# Altium schematic sheet connector.SchDoc
size A3
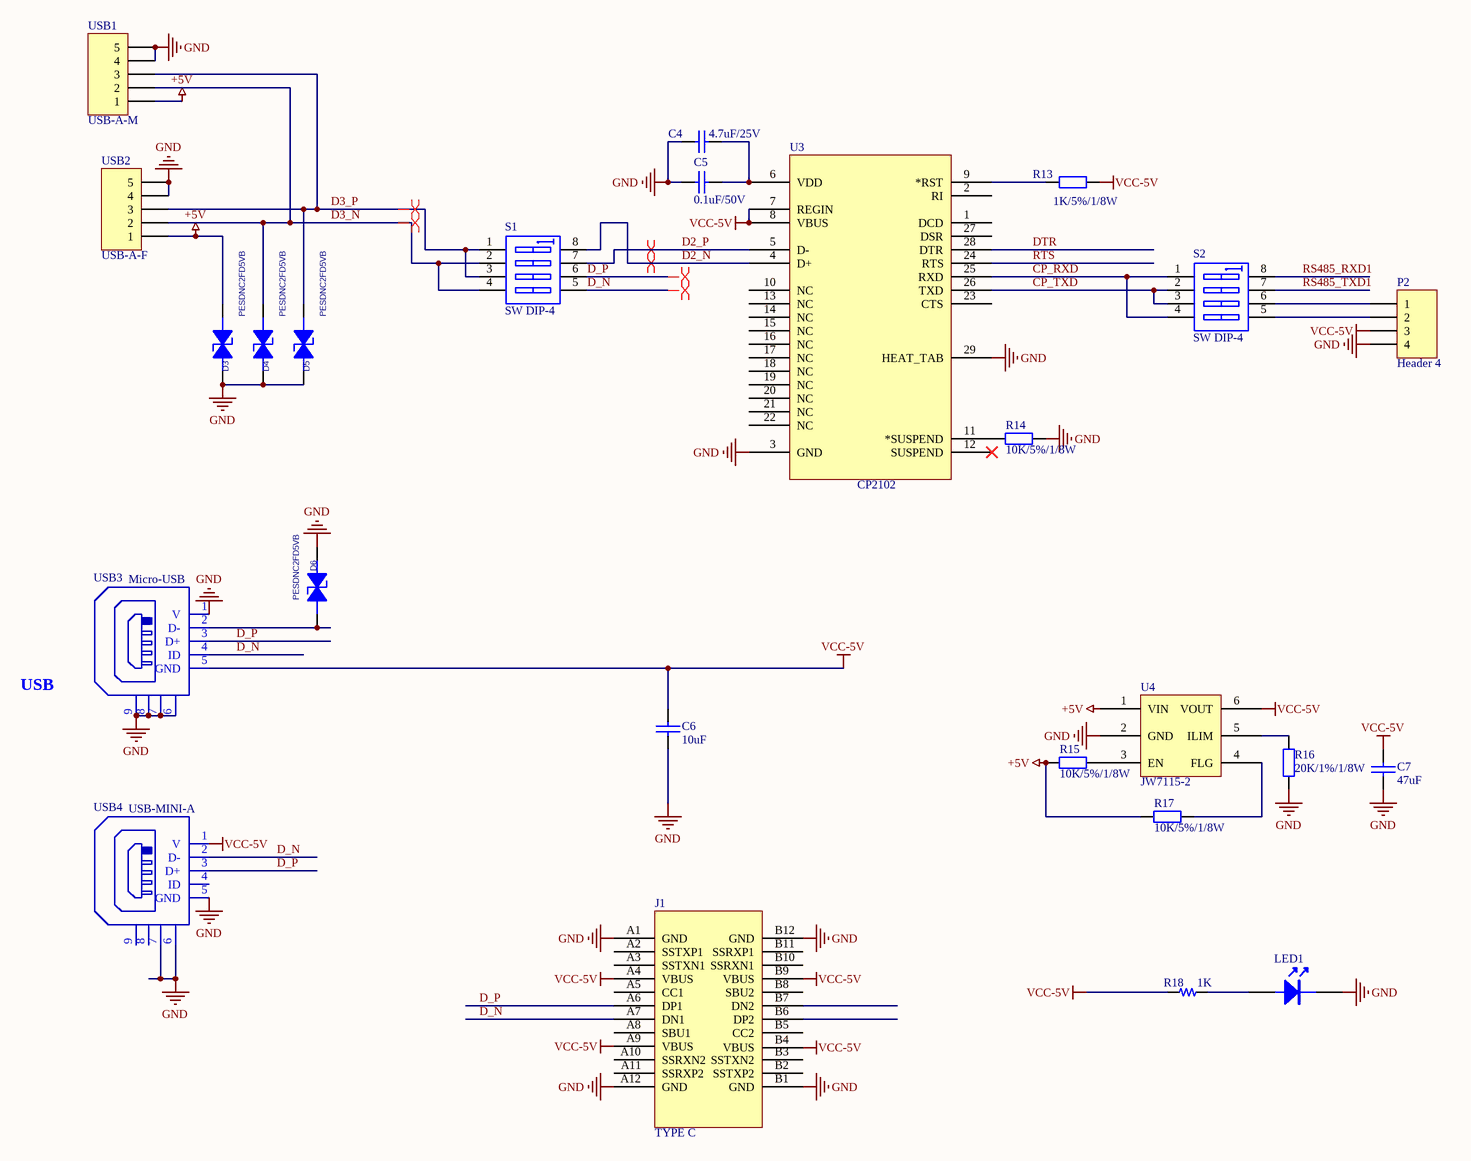
[diagram p0: connector.SchDoc]

## Parts
C4  4.7uF/25V  [0603C]
C5  0.1uF/50V  [C0603]
C6  10uF  [0603C]
C7  47uF  [0603C]
D3  PESDNC2FD5VB  [C0402]
D4  PESDNC2FD5VB  [C0402]
D5  PESDNC2FD5VB  [C0402]
D6  PESDNC2FD5VB  [C0402]
J1  TYPE C  [Type_C-M]
LED1  (no value)  [0603LED]
P2  Header 4  [HDR1X4]
R13  1K/5%/1/8W  [0603R]
R14  10K/5%/1/8W  [0603R]
R15  10K/5%/1/8W  [0603R]
R16  20K/1%/1/8W  [0603R]
R17  10K/5%/1/8W  [0603R]
R18  1K  [0603R]
S1  SW DIP-4  [SW_SMT_8]
S2  SW DIP-4  [SW_SMT_8]
U3  CP2102  [QFN28N5X5-0p5P-L]
U4  JW7115-2  [SOT23-6]
USB1  USB-A-M  [USB_A/P_A]
USB2  USB-A-F  [USB-A]
USB3  Micro-USB  [MICRO USB M]
USB4  USB-MINI-A  [MINIUSB-M]

## Nets
+5V: D3.1(ANODE) R15.2 R17.2 U4.1(VIN) USB1.1 USB2.1
GND: C4.1 C5.2 C6.1 C7.1 D3.2(CATHODE) D4.2(CATHODE) D5.2(CATHODE) D6.2(CATHODE) J1.A1(GND) J1.A12(GND) J1.B1(GND) J1.B12(GND) LED1.2 P2.4 R14.1 R16.2 U3.3(GND) U3.29(HEAT_TAB) U4.2(GND) USB1.4 USB1.5 USB2.4 USB2.5 USB3.1(V) USB3.6 USB3.7 USB3.8 USB3.9 USB4.5(GND) USB4.6 USB4.7
VCC-5V: C6.2 C7.2 J1.A4(VBUS) J1.A9(VBUS) J1.B4(VBUS) J1.B9(VBUS) P2.3 R13.1 R18.1 U3.7(REGIN) U3.8(VBUS) U4.6(VOUT) USB3.5(GND) USB4.1(V)
CP_RXD: S2.1(A1) S2.4(A4) U3.25(RXD)
CP_TXD: S2.2(A2) S2.3(A3) U3.26(TXD)
D2_N: S1.8(B1) U3.4(D+)
D2_P: S1.7(B2) U3.5(D-)
D3_N: D4.1(ANODE) S1.2(A2) S1.4(A4) USB1.2 USB2.2
D3_P: D5.1(ANODE) S1.1(A1) S1.3(A3) USB1.3 USB2.3
D_N: J1.A7(DN1) S1.5(B4) USB3.4(ID) USB4.2(D-)
D_P: J1.A6(DP1) S1.6(B3) USB3.3(D+) USB4.3(D+)
DTR: U3.28(DTR)
RS485_RXD1: S2.8(B1)
RS485_TXD1: S2.7(B2)
RTS: U3.24(RTS)
NetC4_2: C4.2 C5.1 U3.6(VDD)
NetD6_1: D6.1(ANODE) USB3.2(D-)
NetLED1_1: LED1.1 R18.2
NetP2_1: P2.1 S2.6(B3)
NetP2_2: P2.2 S2.5(B4)
NetR13_2: R13.2 U3.9(*RST)
NetR14_2: R14.2 U3.11(*SUSPEND)
NetR15_1: R15.1 U4.3(EN)
NetR16_1: R16.1 U4.5(ILIM)
NetR17_1: R17.1 U4.4(FLG)

Not connected (* = marked no-connect by the designer): J1 A2(SSTXP1) A3(SSTXN1) A5(CC1) A8(SBU1) A10(SSRXN2) A11(SSRXP2) B2(SSTXP2) B3(SSTXN2) B5(CC2) B6(DP2) B7(DN2) B8(SBU2) B10(SSRXN1) B11(SSRXP1); U3 1(DCD) 2(RI) 10(NC) 12(SUSPEND)* 13(NC) 14(NC) 15(NC) 16(NC) 17(NC) 18(NC) 19(NC) 20(NC) 21(NC) 22(NC) 23(CTS) 27(DSR); USB4 4(ID) 8 9

## Layout directives
differential pair: D2_N, D2_P, D3_N, D3_P, D_N, D_P

## Notes on the sheet
- USB

## Library data of the parts
C4 = Cap: Capacitor; Value: 1uF; Published: 8-Jun-2000; LatestRevisionDate: 17-Jul-2002; LatestRevisionNote: Re-released for DXP Platform.; PackageReference: RAD-0.3; Publisher: Altium Limited
C5 = Cap: Capacitor; Value: 104; Published: 8-Jun-2000; LatestRevisionDate: 17-Jul-2002; LatestRevisionNote: Re-released for DXP Platform.; PackageReference: RAD-0.3; Publisher: Altium Limited
C6 C7 = CAP: Capacitor
D3-D6 = 1_1.5KE100A_Dup1: 1ST PART DESCRIPTION: WILL ESD9B5V Bidirection ESD Protection
LED1 = LED
P2 = Header 4: Header, 4-Pin; LatestRevisionDate: 17-Jul-2002; LatestRevisionNote: Re-released for DXP Platform.; Publisher: Altium Limited
R13 = Res2: Resistor; Value: 1K; Published: 8-Jun-2000; LatestRevisionDate: 17-Jul-2002; LatestRevisionNote: Re-released for DXP Platform.; PackageReference: AXIAL-0.4; Publisher: Altium Limited
R14 R15 R17 = Res2: Resistor; Published: 8-Jun-2000; LatestRevisionDate: 17-Jul-2002; LatestRevisionNote: Re-released for DXP Platform.; PackageReference: AXIAL-0.4; Publisher: Altium Limited; Value: 10K/5%/1/8W
R16 = Res2: Resistor; Value: 10K/5%/1/8W; Published: 8-Jun-2000; LatestRevisionDate: 17-Jul-2002; LatestRevisionNote: Re-released for DXP Platform.; PackageReference: AXIAL-0.4; Publisher: Altium Limited
R18 = R
S1 S2 = SW DIP-4: DIP Switch, 4 Position, SPST; Published: 24-Mar-1999; LatestRevisionDate: 29-May-2009; LatestRevisionNote: IPC-7351 Footprint Added.; PackageVersion: Dec-2002; PackageReference: SO8; Publisher: Altium Limited; PackageDescription: 8-Pin Small Outline Integrated Circuit 1.27 mm Pitch; Code_JEDEC: MS-012-AA; Code_IPC: SOIC127P600-8
U3 = CP2102: Imported; PART DESC: SINGLE-CHIP USB TO UART BRIDGE, QFN28, RoHS.; MFG #1: SILICON LABS; PART NUMBER: CP2102; Value: Value; RefDes: RefDes; Type: DEV
USB1 USB2 = Header 5: Header, 5-Pin; LatestRevisionDate: 17-Jul-2002; LatestRevisionNote: Re-released for DXP Platform.; Publisher: Altium Limited
USB3 USB4 = USB